# Altium schematic sheet OverView_TrackCommenderCar_FunctionPart.SchDoc
size 420 x 297 mm; SheetNumber: 1; SheetTotal: 2
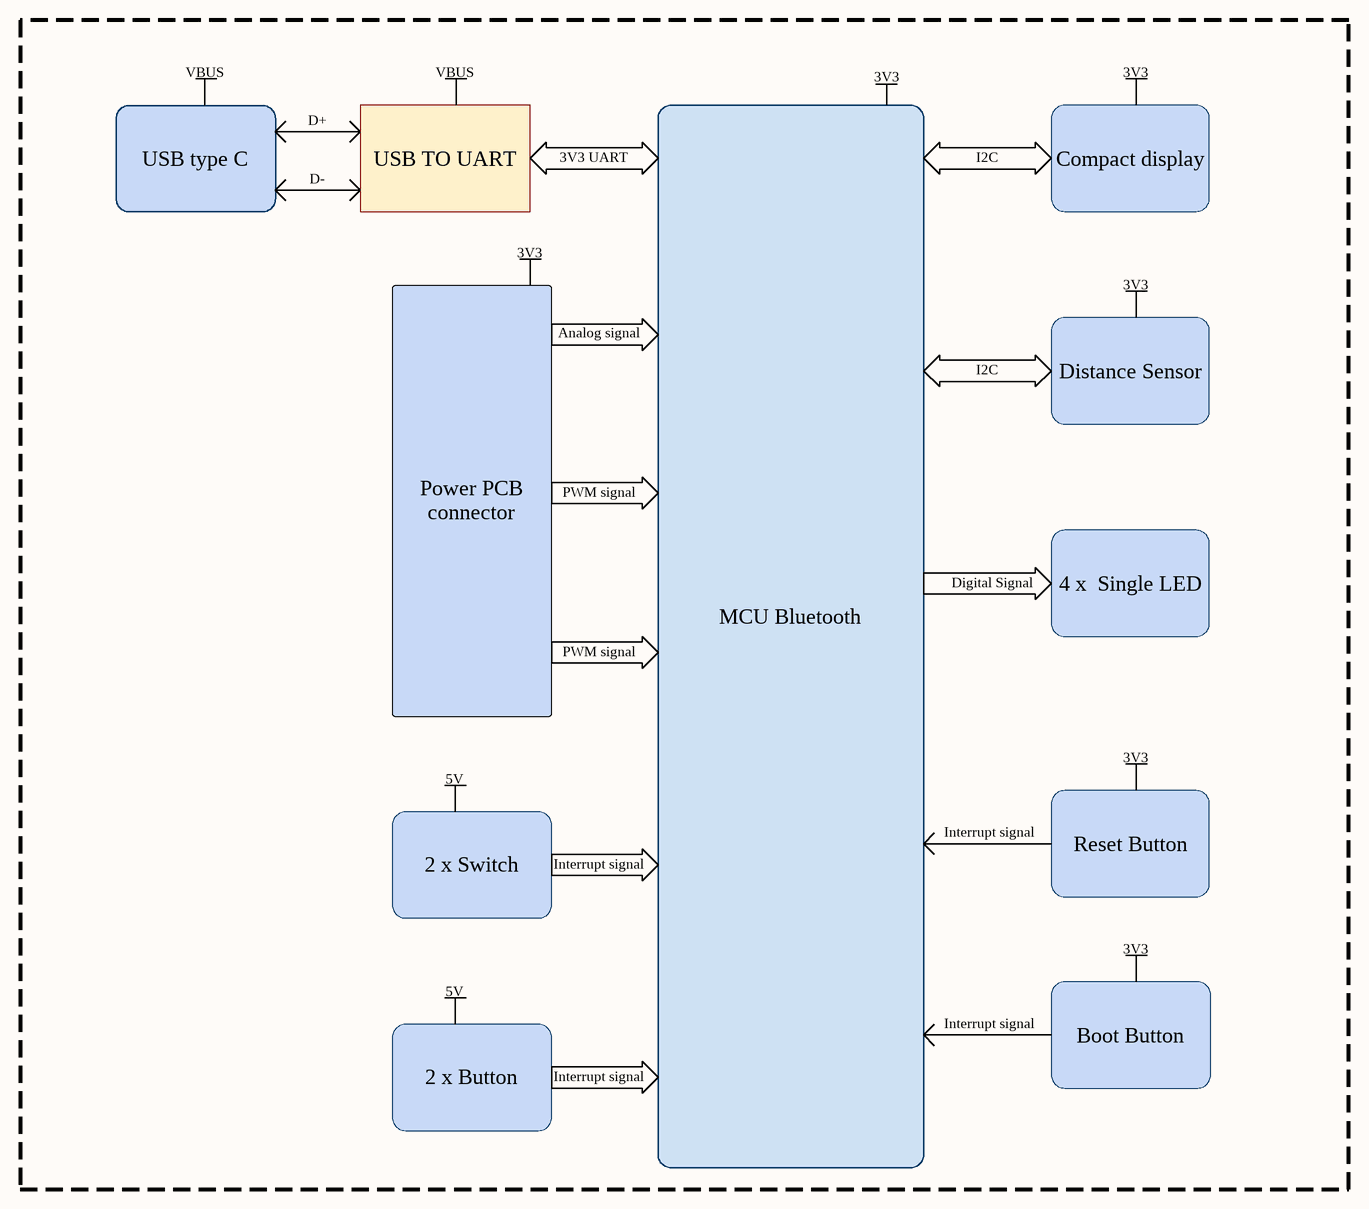
[diagram p0: OverView_TrackCommenderCar_FunctionPart.SchDoc]

## Notes on the sheet
- VBUS
- 3V3
- D+
- USB type C
- D-
- USB TO UART
- 3V3 UART
- I2C
- Compact display
- Analog signal
- Distance Sensor
- Power PCB connector
- PWM signal
- Digital Signal
- 4 x  Single LED
- MCU Bluetooth
- 5V
- 2 x Switch
- Interrupt signal
- Reset Button
- 2 x Button
- Boot Button